# EAGLE design adapter (EAGLE 7.3.0)
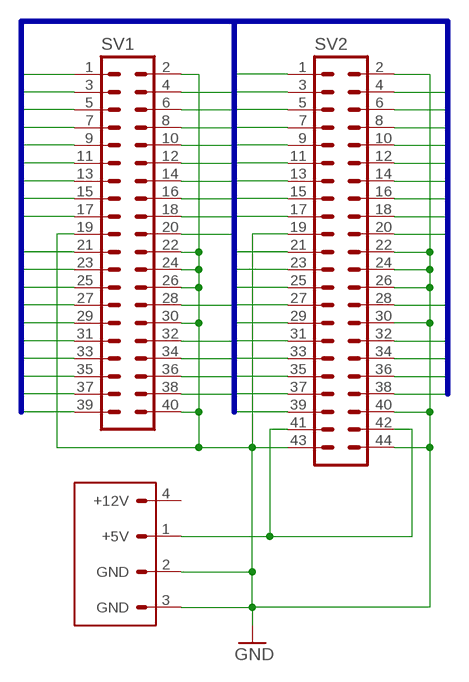
[diagram p0: schematic, sheet 1]

## Parts
SV1  IDE40  [ML40SMD]
SV2  IDE44LOWPITCHF  [PINHEAD2X22F]
U$1  FLOPPYPWR  [FLOPPYPWR]

## Nets
GND: SV1.2(GND) SV1.19(GND) SV1.22(GND) SV1.24(GND) SV1.26(GND) SV1.30(GND) SV1.40(GND) SV2.2(GND) SV2.19(GND) SV2.22(GND) SV2.24(GND) SV2.26(GND) SV2.30(GND) SV2.40(GND) SV2.43(GND) SV2.44(!TYPE!) U$1.2(GND) U$1.3(GND)
IDE1: SV1.1(!RESET!) SV2.1(!RESET!)
IDE3: SV1.3(D7) SV2.3(D7)
IDE4: SV1.4(D8) SV2.4(D8)
IDE5: SV1.5(D6) SV2.5(D6)
IDE6: SV1.6(D9) SV2.6(D9)
IDE7: SV1.7(D5) SV2.7(D5)
IDE8: SV1.8(D10) SV2.8(D10)
IDE9: SV1.9(D4) SV2.9(D4)
IDE10: SV1.10(D11) SV2.10(D11)
IDE11: SV1.11(D3) SV2.11(D3)
IDE12: SV1.12(D12) SV2.12(D12)
IDE13: SV1.13(D2) SV2.13(D2)
IDE14: SV1.14(D13) SV2.14(D13)
IDE15: SV1.15(D1) SV2.15(D1)
IDE16: SV1.16(D14) SV2.16(D14)
IDE17: SV1.17(D0) SV2.17(D0)
IDE18: SV1.18(D15) SV2.18(D15)
IDE20: SV1.20(KEY) SV2.20(KEY)
IDE21: SV1.21(DMARQ) SV2.21(DMARQ)
IDE23: SV1.23(!IOW!) SV2.23(!IOW!)
IDE25: SV1.25(!IOR!) SV2.25(!IOR!)
IDE27: SV1.27(IORDY) SV2.27(IORDY)
IDE28: SV1.28(CSEL) SV2.28(CSEL)
IDE29: SV1.29(!DMACK!) SV2.29(!DMACK!)
IDE31: SV1.31(INTRQ) SV2.31(INTRQ)
IDE32: SV1.32(!IOCS16!) SV2.32(!IOCS16!)
IDE33: SV1.33(A1) SV2.33(A1)
IDE34: SV1.34(DIAG) SV2.34(DIAG)
IDE35: SV1.35(A0) SV2.35(A0)
IDE36: SV1.36(A2) SV2.36(A2)
IDE37: SV1.37(!CS0!) SV2.37(!CS0!)
IDE38: SV1.38(!CS1!) SV2.38(!CS1!)
IDE39: SV1.39(!ACTIVE!) SV2.39(!ACTIVE!)
N$3: SV2.41(VCC) SV2.42(VCC) U$1.1(+5V)
Unconnected: U$1.4(+12V)

## Buses
IDE[1..40]

## Library data of the parts
SV1 = conn:IDE40: 40 pin IDE connector.
SV2 = conn:IDE44: 44 pin IDE connector.
U$1 = conn:FLOPPYPWR

## Board
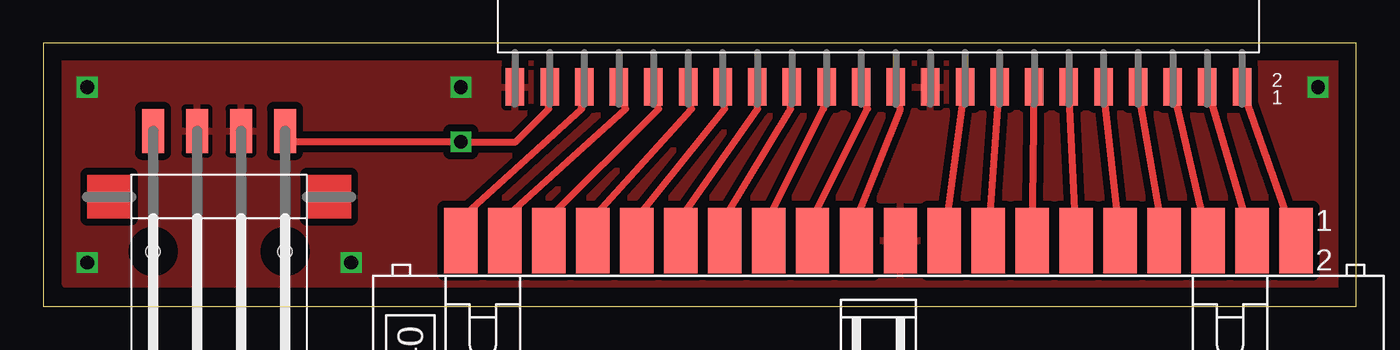
[diagram p1: board, top side]
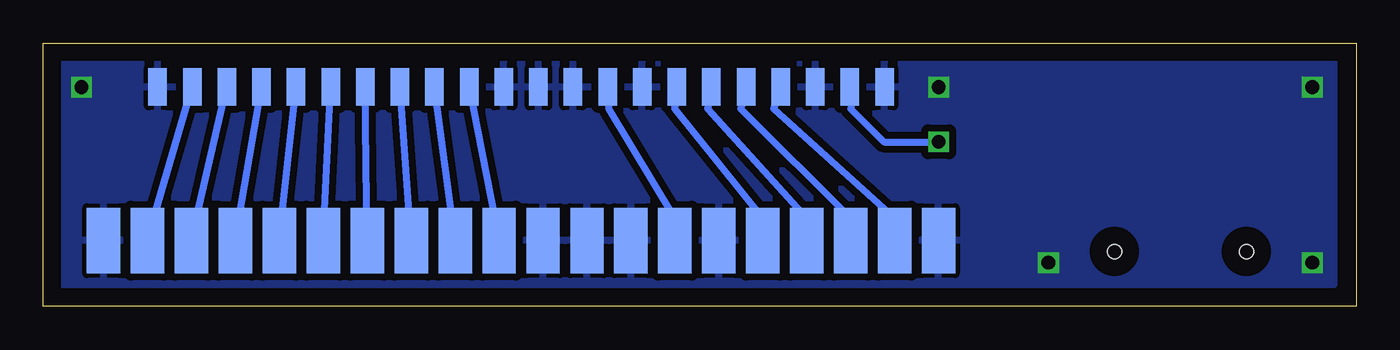
[diagram p2: board, bottom side, seen from below]

Size 75.87 x 15.23 mm. Coordinates in mm from the lower left corner, seen from the top.
Outline: 0,0 75.87,0 75.87,15.23 0,15.23 0,0
Copper layers (1*16): Top 0.035mm / dielectric 1.5mm / Bottom 0.035mm
Design rules "default": minimum track width 10mil, minimum drill 24mil, track to track 8mil, track to pad 8mil, pad to pad 8mil, via to via 8mil, smd to smd 8mil, copper to edge 40mil, drill to drill 8mil, minimum pad ring 10mil, minimum via ring 8mil, stop-mask expansion 4mil, vias tented up to drill 0mil, thermal gap 10mil

### Footprints (pad centres in the part's own frame; a part is rotated, then mirrored left to right if it is on the bottom)
ML40SMD = smd 1.93 x 3.81: 1 -24.13,0; 3 -21.59,0; 5 -19.05,0; 7 -16.51,0; 9 -13.97,0; 11 -11.43,0; 13 -8.89,0; 15 -6.35,0; 17 -3.81,0; 19 -1.27,0; 21 1.27,0; 23 3.81,0; 25 6.35,0; 27 8.89,0; 29 11.43,0; 31 13.97,0; 33 16.51,0; 35 19.05,0; 37 21.59,0; 39 24.13,0 | smd 1.93 x 3.81 bottom: 2 -24.13,0; 4 -21.59,0; 6 -19.05,0; 8 -16.51,0; 10 -13.97,0; 12 -11.43,0; 14 -8.89,0; 16 -6.35,0; 18 -3.81,0; 20 -1.27,0; 22 1.27,0; 24 3.81,0; 26 6.35,0; 28 8.89,0; 30 11.43,0; 32 13.97,0; 34 16.51,0; 36 19.05,0; 38 21.59,0; 40 24.13,0
PINHEAD2X22F = smd 1.067 x 2.184: 1 21,0; 3 19,0; 5 17,0; 7 15,0; 9 13,0; 11 11,0; 13 9,0; 15 7,0; 17 5,0; 19 3,0; 21 1,0; 23 -1,0; 25 -3,0; 27 -5,0; 29 -7,0; 31 -9,0; 33 -11,0; 35 -13,0; 37 -15,0; 39 -17,0; 41 -19,0; 43 -21,0 | smd 1.067 x 2.184 bottom: 2 21,0; 4 19,0; 6 17,0; 8 15,0; 10 13,0; 12 11,0; 14 9,0; 16 7,0; 18 5,0; 20 3,0; 22 1,0; 24 -1,0; 26 -3,0; 28 -5,0; 30 -7,0; 32 -9,0; 34 -11,0; 36 -13,0; 38 -15,0; 40 -17,0; 42 -19,0; 44 -21,0
FLOPPYPWR = smd 1.27 x 2.54: 1 -3.81,0; 2 -1.27,0; 3 1.27,0; 4 3.81,0 | hole 0.8: -3.81,6.985; 3.81,6.985

### Placement (x,y rotation side)
SV1  48.26,3.81 180 top
SV2  48.26,12.7 0 top
U$1  10.16,10.16 180 top

### Tracks (layer width: path | path; a pad name or v marks a point on that pad's centre or on a via)
GND  (via drill 0.8, 0.8 pad 0.61)
  other vias: 2.54,12.7 24.13,12.7 2.54,2.54 73.66,12.7 17.78,2.54
  pour Bottom (isolate 0.406): 1.27,14.61 74.93,14.61 74.93,1.27 1.27,1.27
  pour Top (isolate 0.406): 1.27,14.61 74.93,14.61 74.93,1.27 1.27,1.27
IDE1
  Top 0.406: SV1.1 SV2.1
IDE3
  Top 0.406: SV1.3 SV2.3
IDE4
  Bottom 0.406: SV1.4 SV2.4
IDE5
  Top 0.406: SV1.5 SV2.5
IDE6
  Bottom 0.406: SV1.6 SV2.6
IDE7
  Top 0.406: SV1.7 SV2.7
IDE8
  Bottom 0.406: SV1.8 SV2.8
IDE9
  Top 0.406: SV1.9 SV2.9
IDE10
  Bottom 0.406: SV1.10 SV2.10
IDE11
  Top 0.406: SV1.11 SV2.11
IDE12
  Bottom 0.406: SV1.12 SV2.12
IDE13
  Top 0.406: SV1.13 SV2.13
IDE14
  Bottom 0.406: SV1.14 SV2.14
IDE15
  Top 0.406: SV1.15 SV2.15
IDE16
  Bottom 0.406: SV1.16 SV2.16
IDE17
  Top 0.406: SV1.17 SV2.17
IDE18
  Bottom 0.406: SV1.18 SV2.18
IDE20
  Bottom 0.406: SV2.20 SV1.20
IDE21
  Top 0.406: SV1.21 46.99,5.08 49.53,11.43 SV2.21
IDE23
  Top 0.406: SV1.23 44.45,5.08 47.62,11.43 SV2.23
IDE25
  Top 0.406: SV1.25 41.91,5.08 45.09,11.43 SV2.25
IDE27
  Top 0.406: SV1.27 39.37,5.08 43.18,11.43 SV2.27
IDE28
  Bottom 0.406: SV2.28 43.18,11.43 39.37,5.08 SV1.28
IDE29
  Top 0.406: SV1.29 36.83,5.08 41.28,11.43 SV2.29
IDE31
  Top 0.406: SV1.31 34.29,5.08 39.37,11.43 SV2.31
IDE32
  Bottom 0.406: SV1.32 34.29,5.08 39.37,11.43 SV2.32
IDE33
  Top 0.406: SV1.33 31.75,5.08 37.47,11.43 SV2.33
IDE34
  Bottom 0.406: SV1.34 31.75,5.08 37.47,11.43 SV2.34
IDE35
  Top 0.406: SV1.35 29.21,5.08 35.56,11.43 SV2.35
IDE36
  Bottom 0.406: SV1.36 29.21,5.08 35.56,11.43 SV2.36
IDE37
  Top 0.406: SV1.37 26.67,5.08 33.66,11.43 SV2.37
IDE38
  Bottom 0.406: SV1.38 26.67,5.08 33.66,11.43 SV2.38
IDE39
  Top 0.406: SV1.39 24.13,5.08 31.11,11.43 SV2.39
N$3  (via drill 0.8)
  Top 0.406: SV2.41 29.21,12.65 29.21,11.43 27.3,9.53 v24.13,9.53 14.61,9.53 U$1.1
  Bottom 0.406: SV2.41 29.21,11.43 27.3,9.53 v24.13,9.53